# Altium schematic sheet ETH_RJ45wLED.SchDoc
size A3
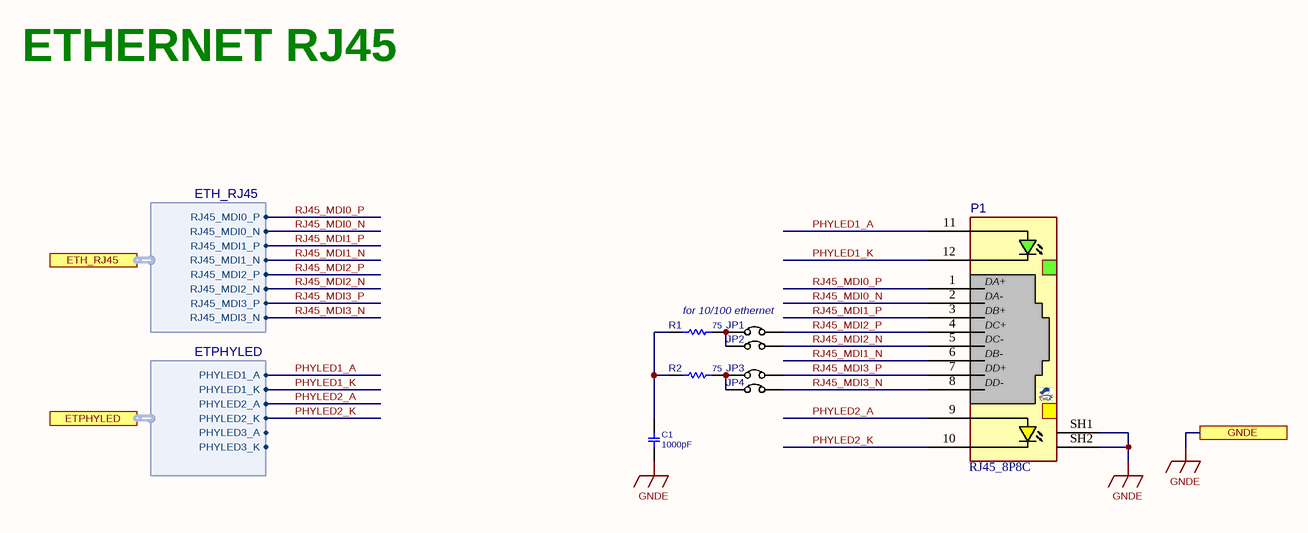
[diagram p0: ETH_RJ45wLED.SchDoc]

## Parts
C1  1000pF  [C1206]
JP1  JMPSOLDER  [JP_30X50]  (value not drawn)
JP2  JMPSOLDER  [JP_30X50]  (value not drawn)
JP3  JMPSOLDER  [JP_30X50]  (value not drawn)
JP4  JMPSOLDER  [JP_30X50]  (value not drawn)
P1  RJ45_8P8C  [RJ45_8S_RA_TU_L]
R1  75  [R0603O]
R2  75  [R0603O]

## Ports
ETH_RJ45 (harness ETH_RJ45), ETPHYLED (harness ETPHYLED), GNDE

## Harnesses
ETPHYLED: PHYLED1_A, PHYLED1_K, PHYLED2_A, PHYLED2_K, PHYLED3_A, PHYLED3_K
ETH_RJ45: RJ45_MDI0_P, RJ45_MDI0_N, RJ45_MDI1_P, RJ45_MDI1_N, RJ45_MDI2_P, RJ45_MDI2_N, RJ45_MDI3_P, RJ45_MDI3_N

## Nets
GNDE: C1.2 P1.SH1 P1.SH2 ; port GNDE
PHYLED1_A: P1.11(GLED+) ; port ETPHYLED.PHYLED1_A
PHYLED1_K: P1.12(GLED-) ; port ETPHYLED.PHYLED1_K
PHYLED2_A: P1.9(YLED+) ; port ETPHYLED.PHYLED2_A
PHYLED2_K: P1.10(YLED-) ; port ETPHYLED.PHYLED2_K
RJ45_MDI0_N: P1.2(DA-) ; port ETH_RJ45.RJ45_MDI0_N
RJ45_MDI0_P: P1.1(DA+) ; port ETH_RJ45.RJ45_MDI0_P
RJ45_MDI1_N: P1.6(DB-) ; port ETH_RJ45.RJ45_MDI1_N
RJ45_MDI1_P: P1.3(DB+) ; port ETH_RJ45.RJ45_MDI1_P
RJ45_MDI2_N: JP2.2 P1.5(DC-) ; port ETH_RJ45.RJ45_MDI2_N
RJ45_MDI2_P: JP1.2 P1.4(DC+) ; port ETH_RJ45.RJ45_MDI2_P
RJ45_MDI3_N: JP4.2 P1.8(DD-) ; port ETH_RJ45.RJ45_MDI3_N
RJ45_MDI3_P: JP3.2 P1.7(DD+) ; port ETH_RJ45.RJ45_MDI3_P
NetC1_1: C1.1 R1.1 R2.1
NetJP1_1: JP1.1 JP2.1 R1.2
NetJP3_1: JP3.1 JP4.1 R2.2

## Notes on the sheet
- ETHERNET RJ45
- for 10/100 ethernet

## Library data of the parts
C1 = CAP_SMD_MLCC_22n50V: CAP, MLCC; MANF_P#: 1206B102K202NT; PARAM2: 2kV; MANF: -; PARAM: -; DESC: -; PRICE: $0.006; VALUE: 1000pF
JP1-JP4 = JUMPER_SOLDER: JUMPER, HEADER 2PIN; MANF: MANF; MANF_P#: MANF_P#; VALUE: JMPSOLDER
P1 = RJ45_8S_RA_TU_L: RJ45, 8P+LED, SHIELDED, RightAngle, TabUP; MANF: WURTH; MANF_P#: 615008137421; PRICE: 1.2$; VALUE: RJ45_8P8C
R1 R2 = RES_SMD_1K_0402YK: RESISTOR, SMD, THICK FILM, YAGEO; MANF_P#: RC0402FR-071KL; PARAM: 0.063W; DESC: DESCRIPTION; DIST#: MOUSER; PARAM2: 1%; MANF: Yageo; ASSEMBLY: ASSEMBLY; PRICE: 100= 0.3$; VALUE: 75